# EAGLE design buttons_v2 (EAGLE 7.7.0)
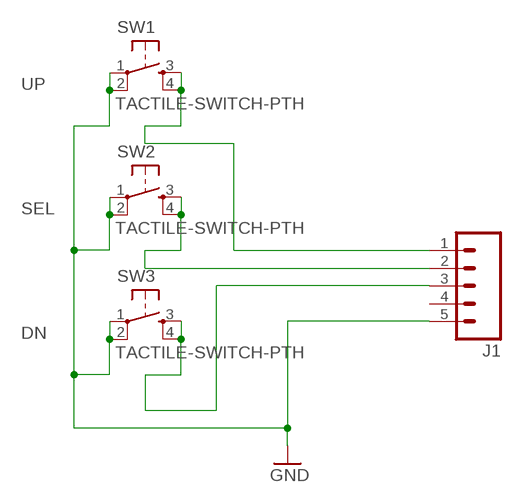
[diagram p0: schematic, sheet 1]

## Parts
J1  M05PTH  [1X05]
SW1  TACTILE-SWITCH-PTH  [TAC-SWITCH-PTH]
SW2  TACTILE-SWITCH-PTH  [TAC-SWITCH-PTH]
SW3  TACTILE-SWITCH-PTH  [TAC-SWITCH-PTH]

## Nets
GND: J1.5 SW1.1 SW1.2 SW2.1 SW2.2 SW3.1 SW3.2
N$2: J1.1 SW1.3 SW1.4
N$3: J1.3 SW3.3 SW3.4
N$4: J1.2 SW2.3 SW2.4
Unconnected: J1.4

## Notes on the sheet
- UP
- SEL
- DN

## Library data of the parts
J1 = SparkFun-Connectors:M05: Header 5 Standard 5-pin 0.1" header. Use with straight break away headers (SKU : PRT-00116), right angle break away headers (PRT-00553), swiss pins (PRT-00743), machine pins (PRT-00117), and female headers (PRT-00115). Molex polarized connector foot print use with SKU : PRT-08230 with associated crimp pins and housings.
SW1-SW3 = GeekAmmo:TACTILE-SWITCH: Tactile Switch 4 Pins, SPST NO

## Board
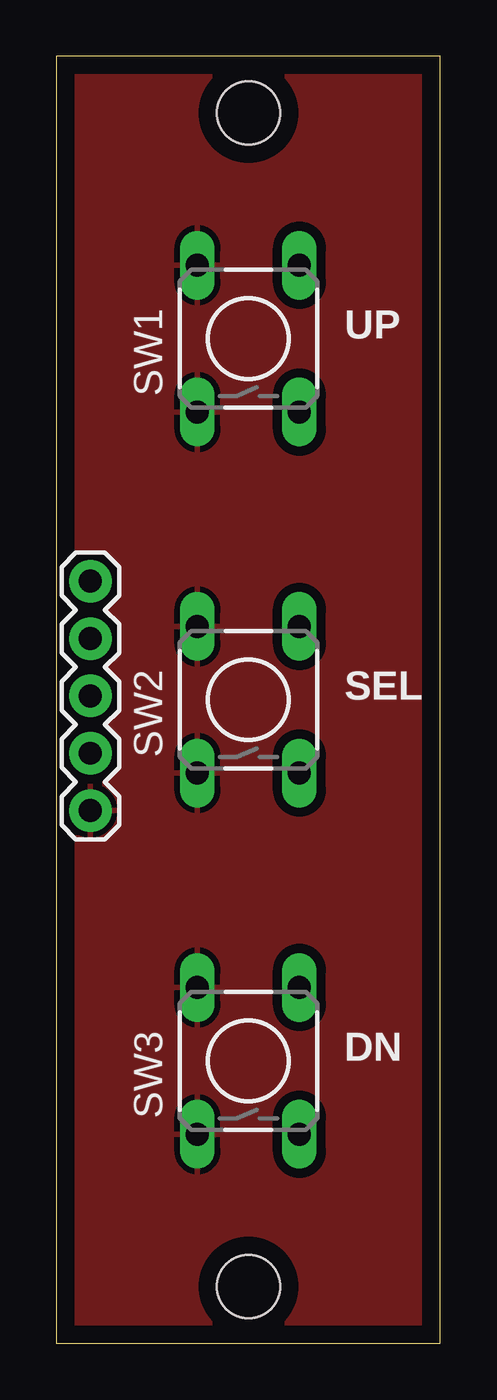
[diagram p1: board, top side]
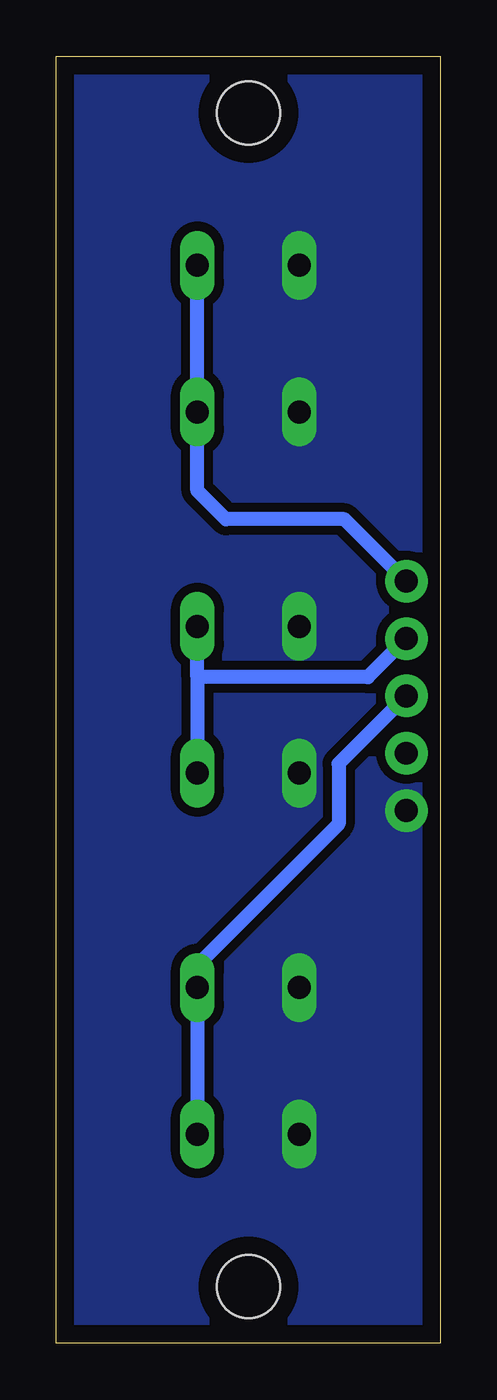
[diagram p2: board, bottom side, seen from below]

Size 17 x 57 mm. Coordinates in mm from the lower left corner, seen from the top.
Outline: 0,0 17,0 17,57 0,57 0,0
Copper layers (1*16): Top 0.035mm / dielectric 1.5mm / Bottom 0.035mm
Design rules "default *": minimum track width 10mil, minimum drill 24mil, track to track 0.4mm, track to pad 0.4mm, pad to pad 0.4mm, via to via 0.4mm, smd to smd 0.4mm, copper to edge 0.8mm, drill to drill 0.4mm, minimum pad ring 10mil, minimum via ring 8mil, stop-mask expansion 4mil, vias tented up to drill 0mil, thermal gap 10mil
Holes 2.8 mm at 8.5,2.5 8.5,54.5

### Footprints (pad centres in the part's own frame; a part is rotated, then mirrored left to right if it is on the bottom)
1X05 = drill 1.016 pad 1.88: 1 0,0; 2 2.54,0; 3 5.08,0; 4 7.62,0; 5 10.16,0
TAC-SWITCH-PTH = drill 1.016 pad 1.524 long: 1 -3.251,2.261; 2 3.251,2.261; 3 -3.251,-2.261; 4 3.251,-2.261

### Placement (x,y rotation side)
J1  1.5,33.75 270 top
SW1  8.5,44.5 90 top
SW2  8.5,28.5 90 top
SW3  8.5,12.5 90 top

### Tracks (layer width: path | path; a pad name or v marks a point on that pad's centre or on a via)
GND
  pour Bottom (isolate 0.406, no thermals): 0,57 17,57 17,0 0,0
  pour Top (isolate 0.406): 0,57 17,57 17,0 0,0
N$2
  Bottom 0.61: J1.1 4.25,36.5 9.5,36.5 10.76,37.76 SW1.3 SW1.4
N$3
  Bottom 0.61: J1.3 4.5,25.67 4.5,23 10.76,16.74 SW3.4 SW3.3
N$4
  Bottom 0.61: J1.2 3.21,29.5 10.75,29.5 | 10.75,29.5 10.76,29.51 SW2.4 | SW2.3 10.75,29.5

### Text on the board
tPlace: UP | SEL | DN